# Altium project NetworkModule.PrjPcb
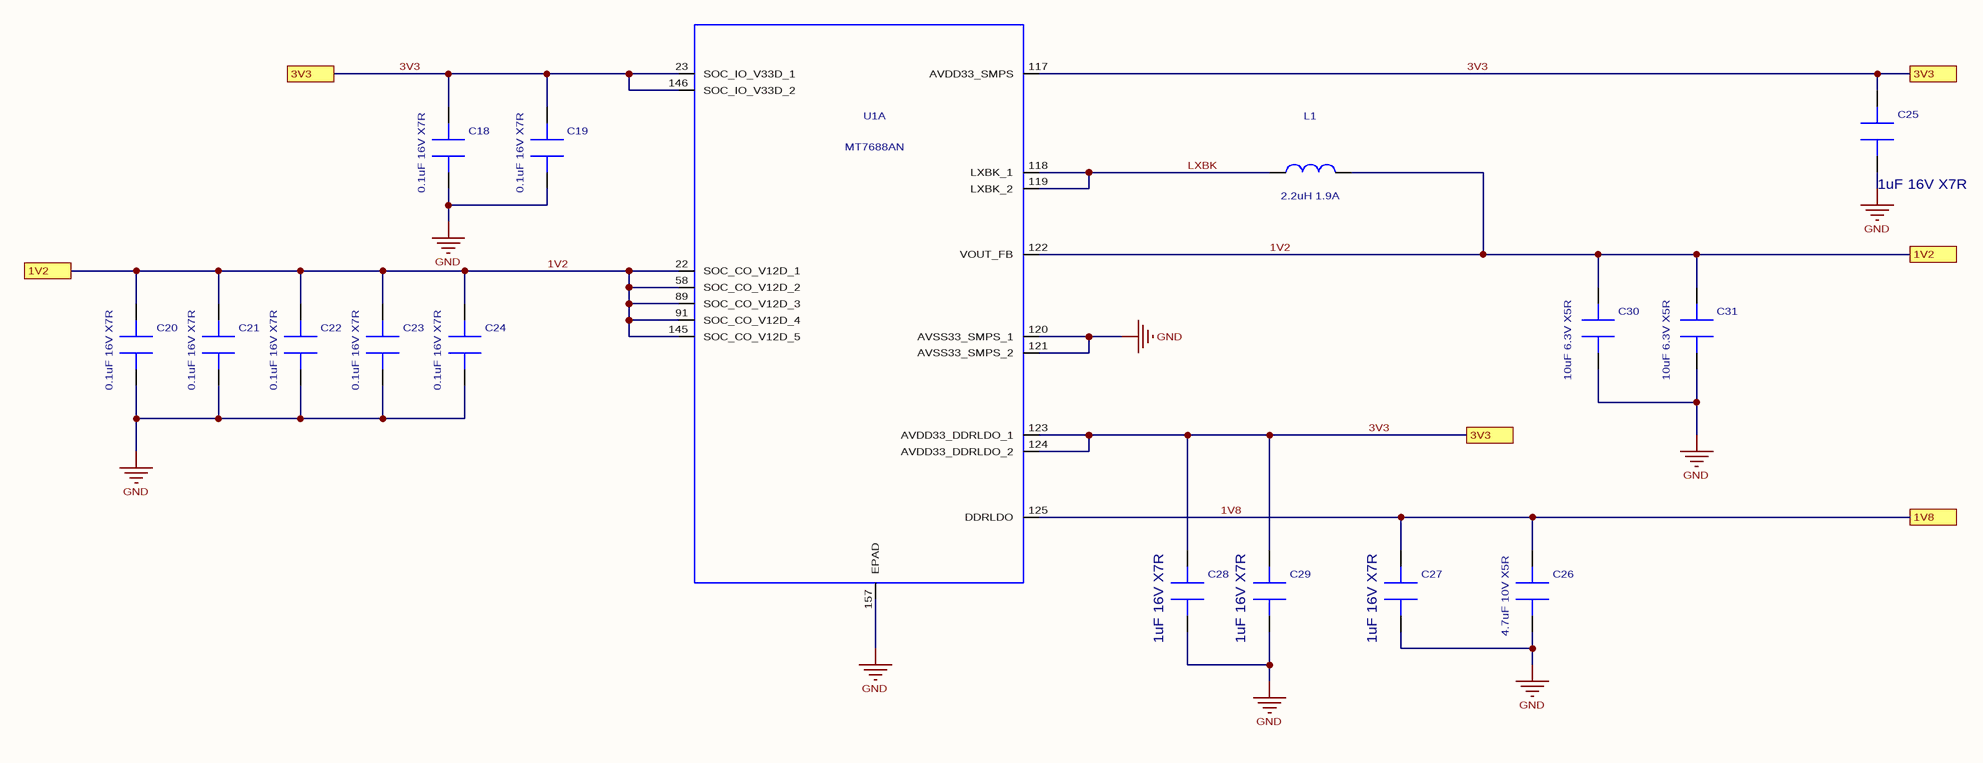
[diagram p0: POWER.SchDoc]
6 sheets, 109 parts. Net scope: flat (ports and power ports of the same name join across sheets).
Board file: NetworkModule.PcbDoc
Sheets:
  POWER.SchDoc
  MEMORY.SchDoc
  MISC.SchDoc
  ETH_JTAG_SD.SchDoc
  WIFI.SchDoc
  USB_PCIE.SchDoc

## Sheet POWER.SchDoc: Network Module
size 431 x 279 mm; DrawnBy: Bin Xiao; Organization: RYSE Inc.

### Parts
C18  value 0.1uF 16V X7R  [C0201]  (hidden comment: CAP0201-104-16V-X7R)
C19  value 0.1uF 16V X7R  [C0201]  (hidden comment: CAP0201-104-16V-X7R)
C20  value 0.1uF 16V X7R  [C0201]  (hidden comment: CAP0201-104-16V-X7R)
C21  value 0.1uF 16V X7R  [C0201]  (hidden comment: CAP0201-104-16V-X7R)
C22  value 0.1uF 16V X7R  [C0201]  (hidden comment: CAP0201-104-16V-X7R)
C23  value 0.1uF 16V X7R  [C0201]  (hidden comment: CAP0201-104-16V-X7R)
C24  value 0.1uF 16V X7R  [C0201]  (hidden comment: CAP0201-104-16V-X7R)
C25  value 1uF 16V X7R  [C0402]  (hidden comment: CAP0402-105-6.3V-X7R)
C26  value 4.7uF 10V X5R  [C0402]  (hidden comment: CAP0402-475-10V-X5R)
C27  value 1uF 16V X7R  [C0402]  (hidden comment: CAP0402-105-6.3V-X7R)
C28  value 1uF 16V X7R  [C0402]  (hidden comment: CAP0402-105-6.3V-X7R)
C29  value 1uF 16V X7R  [C0402]  (hidden comment: CAP0402-105-6.3V-X7R)
C30  value 10uF 6.3V X5R  [C0402]  (hidden comment: CAP0402-106-6.3V-X5R)
C31  value 10uF 6.3V X5R  [C0402]  (hidden comment: CAP0402-106-6.3V-X5R)
L1  value 2.2uH 1.9A  [L0805]  (hidden comment: IND0805_2.2U_1.9A)
U1  MT7688AN  [DR-QFN-128]  (part A of 6)

### Ports
1V2, 1V8, 3V3

### Nets
GND: C18.2 C19.2 C20.2 C21.2 C22.2 C23.2 C24.2 C25.2 C26.2 C27.2 C28.2 C29.2 C30.2 C31.2 U1.120(AVSS33_SMPS_1) U1.121(AVSS33_SMPS_2) U1.157(EPAD)
1V2: C20.1 C21.1 C22.1 C23.1 C24.1 C30.1 C31.1 L1.2 U1.22(SOC_CO_V12D_1) U1.58(SOC_CO_V12D_2) U1.89(SOC_CO_V12D_3) U1.91(SOC_CO_V12D_4) U1.122(VOUT_FB) U1.145(SOC_CO_V12D_5) ; port 1V2
1V8: C26.1 C27.1 U1.125(DDRLDO) ; port 1V8
3V3: C18.1 C19.1 C25.1 C28.1 C29.1 U1.23(SOC_IO_V33D_1) U1.117(AVDD33_SMPS) U1.123(AVDD33_DDRLDO_1) U1.124(AVDD33_DDRLDO_2) U1.146(SOC_IO_V33D_2) ; port 3V3
LXBK: L1.1 U1.118(LXBK_1) U1.119(LXBK_2)

### Library data of the parts
C18-C24 = CAP0201-104-16V-X7R: CAP CER 0.1UF 16V X7R 0201; Part Number: GRM033Z71C104KE14D; Manufacturer: Murata Electronics; Prefered Vender: Digikey; Aligni Value: 0.1u; Type: Capacitor; Geometry.Height: 0.33mm; PCB DECAL: RC0201; Revision: A
C25 C27-C29 = CAP0402-105-6.3V-X7R: CAP CER 1UF 6.3V X7R 0402; Part Number: GRM155R70J105KA12D; Manufacturer: Murata Electronics; Prefered Vender: Digikey; Aligni Value: 1u; Type: Capacitor; Geometry.Height: 0.33mm; PCB DECAL: RC0402; Revision: A
C26 = CAP0402-475-10V-X5R: CAP CER 4.7UF 10V X5R 0402; Part Number: CL05A475MP5NRNC; Manufacturer: Samsung Electro-Mechanics; Prefered Vender: Digikey; Aligni Value: 4.7u; Type: Capacitor; Geometry.Height: 0.33mm; PCB DECAL: RC0402; Revision: A
C30 C31 = CAP0402-475-10V-X5R: CAP CER 10UF 6.3V X5R 0402; Part Number: GRM155R60J106ME05J; Manufacturer: Murata Electronics; Prefered Vender: Digikey; Aligni Value: 10u; Type: Capacitor; Geometry.Height: 0.33mm; Revision: A; PCB DECAL: C0402
L1 = IND0805_2.2U_1.9A: POWER CHOKE MOLDED 2.2UH 1.9A; Part Number: WLPH201610M2R2PP; Manufacturer: Walsin Technology Corporation; Prefered Vender: Digikey; Geometry.Height: 1.5mm; Aligni Value: 2.2u; Type: Inductor; PCB DECAL: RC0805; Revision: A
U1 = MT7688AN: 580Mhz 32bits Networking Processor; Manufacturer: MediaTek Inc; Geometry.Height: 0mm; Type: IC; Part Number: MT7688AN; PCB DECAL: DR-QFN-128

## Sheet MEMORY.SchDoc: Network Module
size 431 x 279 mm; DrawnBy: Bin Xiao; Organization: RYSE Inc.; Revision: A
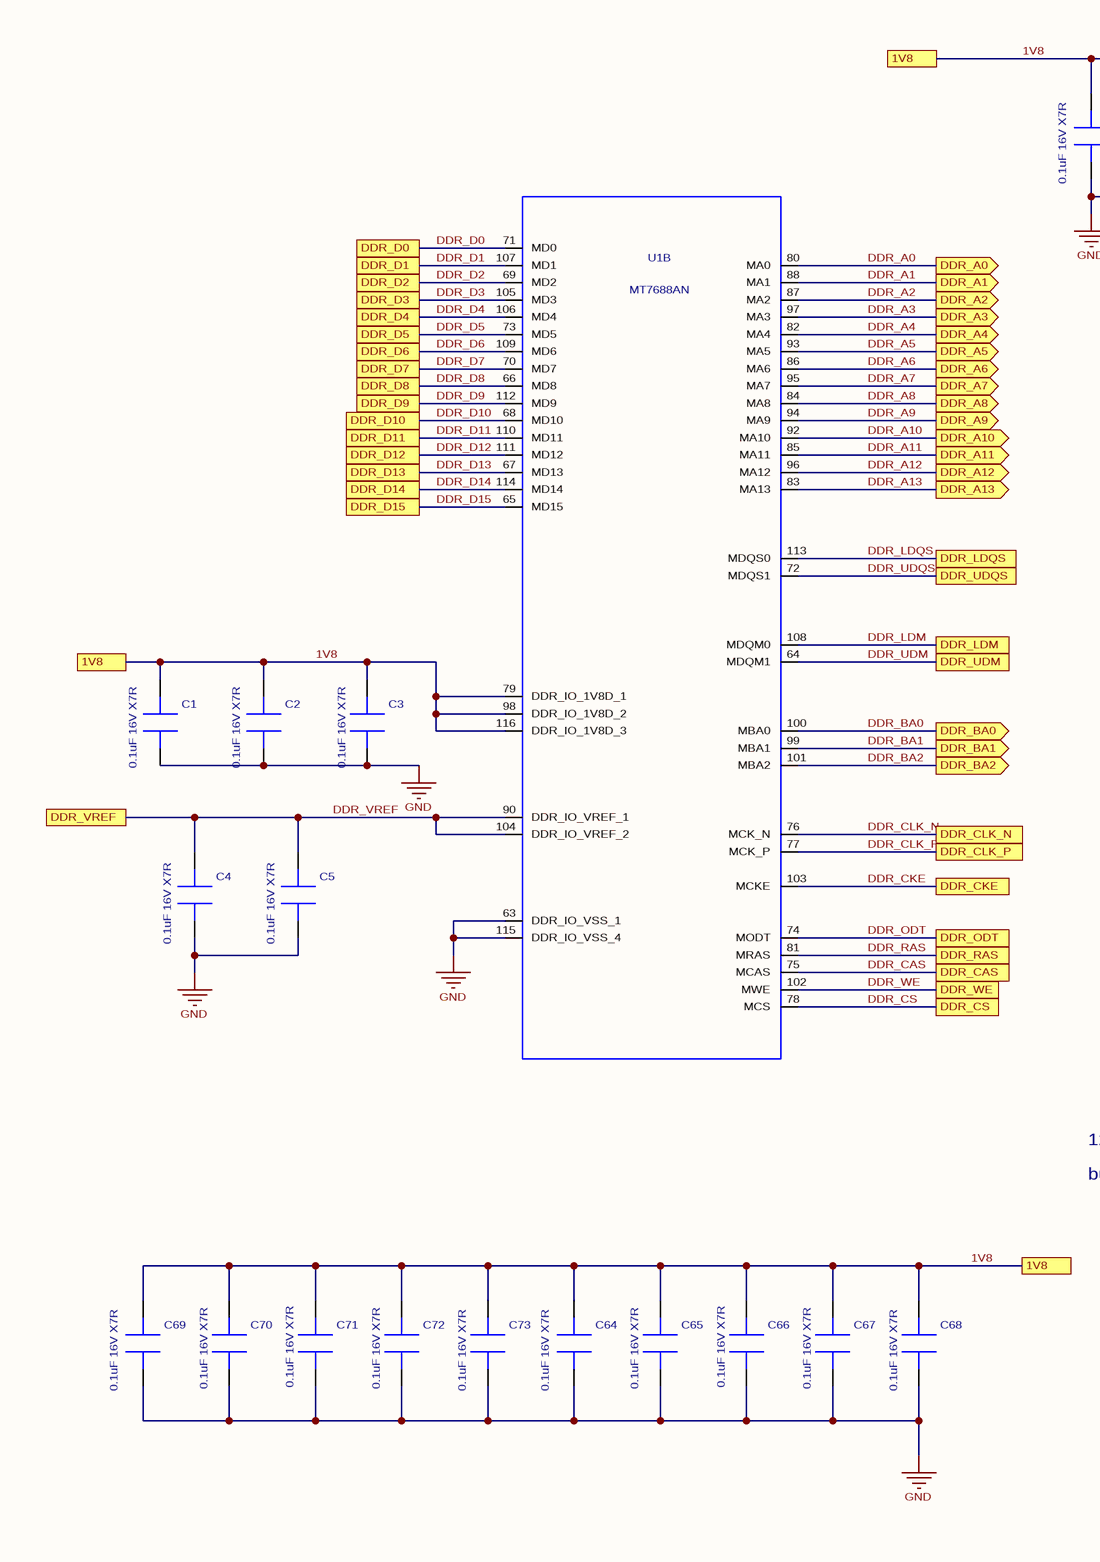
[diagram p1: MEMORY.SchDoc, left]
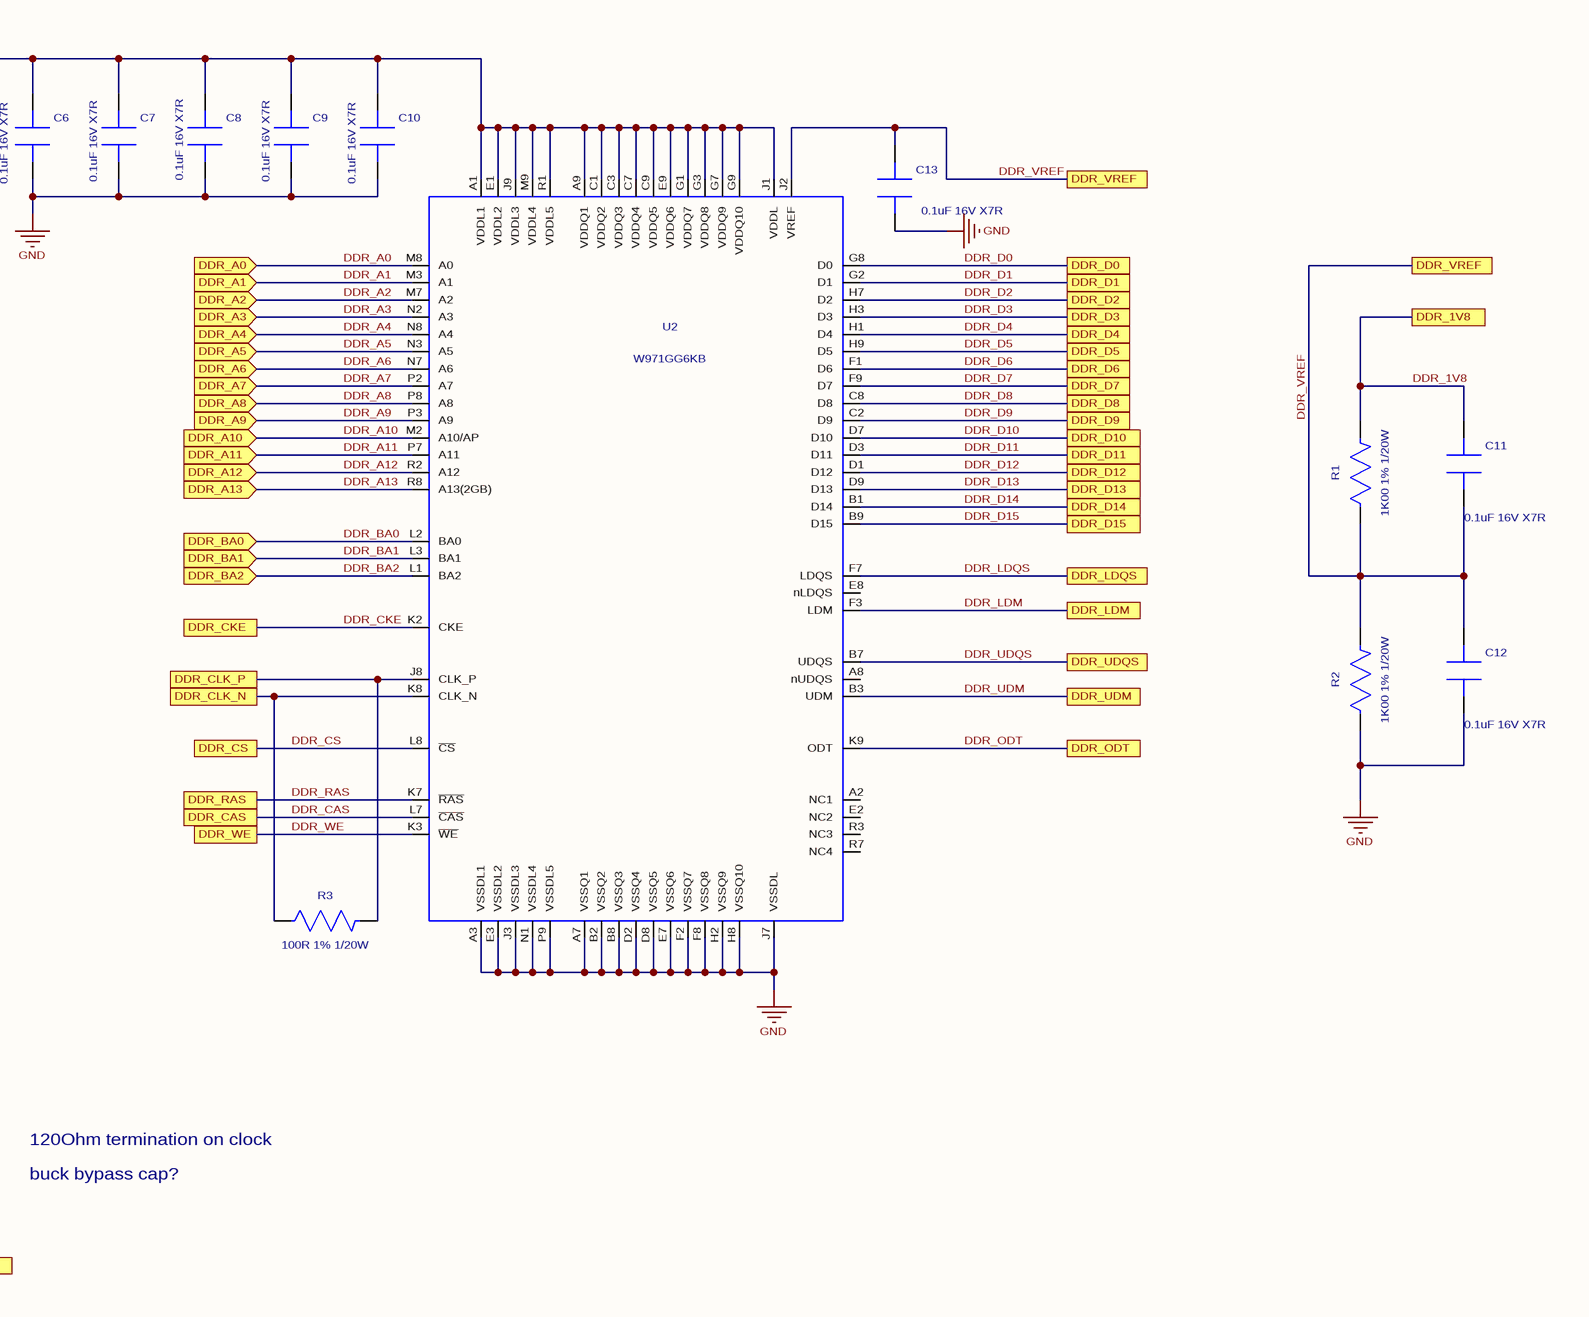
[diagram p2: MEMORY.SchDoc, right]

### Parts
C1  value 0.1uF 16V X7R  [C0201]  (hidden comment: CAP0201-104-16V-X7R)
C2  value 0.1uF 16V X7R  [C0201]  (hidden comment: CAP0201-104-16V-X7R)
C3  value 0.1uF 16V X7R  [C0201]  (hidden comment: CAP0201-104-16V-X7R)
C4  value 0.1uF 16V X7R  [C0201]  (hidden comment: CAP0201-104-16V-X7R)
C5  value 0.1uF 16V X7R  [C0201]  (hidden comment: CAP0201-104-16V-X7R)
C6  value 0.1uF 16V X7R  [C0201]  (hidden comment: CAP0201-104-16V-X7R)
C7  value 0.1uF 16V X7R  [C0201]  (hidden comment: CAP0201-104-16V-X7R)
C8  value 0.1uF 16V X7R  [C0201]  (hidden comment: CAP0201-104-16V-X7R)
C9  value 0.1uF 16V X7R  [C0201]  (hidden comment: CAP0201-104-16V-X7R)
C10  value 0.1uF 16V X7R  [C0201]  (hidden comment: CAP0201-104-16V-X7R)
C11  value 0.1uF 16V X7R  [C0201]  (hidden comment: CAP0201-104-16V-X7R)
C12  value 0.1uF 16V X7R  [C0201]  (hidden comment: CAP0201-104-16V-X7R)
C13  value 0.1uF 16V X7R  [C0201]  (hidden comment: CAP0201-104-16V-X7R)
C64  value 0.1uF 16V X7R  [C0201]  (hidden comment: CAP0201-104-16V-X7R)
C65  value 0.1uF 16V X7R  [C0201]  (hidden comment: CAP0201-104-16V-X7R)
C66  value 0.1uF 16V X7R  [C0201]  (hidden comment: CAP0201-104-16V-X7R)
C67  value 0.1uF 16V X7R  [C0201]  (hidden comment: CAP0201-104-16V-X7R)
C68  value 0.1uF 16V X7R  [C0201]  (hidden comment: CAP0201-104-16V-X7R)
C69  value 0.1uF 16V X7R  [C0201]  (hidden comment: CAP0201-104-16V-X7R)
C70  value 0.1uF 16V X7R  [C0201]  (hidden comment: CAP0201-104-16V-X7R)
C71  value 0.1uF 16V X7R  [C0201]  (hidden comment: CAP0201-104-16V-X7R)
C72  value 0.1uF 16V X7R  [C0201]  (hidden comment: CAP0201-104-16V-X7R)
C73  value 0.1uF 16V X7R  [C0201]  (hidden comment: CAP0201-104-16V-X7R)
R1  value 1K00 1% 1/20W  [R0201]  (hidden comment: RES0201-1K00)
R2  value 1K00 1% 1/20W  [R0201]  (hidden comment: RES0201-1K00)
R3  value 100R 1% 1/20W  [R0201]  (hidden comment: RES0201-100R)
U1  MT7688AN  [DR-QFN-128]  (part B of 6)
U2  W971GG6KB  [TWBGA-84_8X12P5_ISI]

### Ports
1V8, DDR_1V8, DDR_A0 (in), DDR_A0 (out), DDR_A1 (in), DDR_A1 (out), DDR_A2 (in), DDR_A2 (out), DDR_A3 (in), DDR_A3 (out), DDR_A4 (in), DDR_A4 (out), DDR_A5 (in), DDR_A5 (out), DDR_A6 (in), DDR_A6 (out), DDR_A7 (in), DDR_A7 (out), DDR_A8 (in), DDR_A8 (out), DDR_A9 (in), DDR_A9 (out), DDR_A10 (in), DDR_A10 (out), DDR_A11 (in), DDR_A11 (out), DDR_A12 (in), DDR_A12 (out), DDR_A13 (in), DDR_A13 (out), DDR_BA0 (in), DDR_BA0 (out), DDR_BA1 (in), DDR_BA1 (out), DDR_BA2 (in), DDR_BA2 (out), DDR_CAS, DDR_CKE, DDR_CLK_N, DDR_CLK_P, DDR_CS, DDR_D0, DDR_D1, DDR_D2, DDR_D3, DDR_D4, DDR_D5, DDR_D6, DDR_D7, DDR_D8, DDR_D9, DDR_D10, DDR_D11, DDR_D12, DDR_D13, DDR_D14, DDR_D15, DDR_LDM, DDR_LDQS, DDR_ODT, DDR_RAS, DDR_UDM, DDR_UDQS, DDR_VREF, DDR_WE

### Nets
GND: C1.2 C2.2 C3.2 C4.2 C5.2 C6.2 C7.2 C8.2 C9.2 C10.2 C12.2 C13.2 C64.2 C65.2 C66.2 C67.2 C68.2 C69.2 C70.2 C71.2 C72.2 C73.2 R2.1 U1.63(DDR_IO_VSS_1) U1.115(DDR_IO_VSS_4) U2.A3(VSSDL1) U2.A7(VSSQ1) U2.B2(VSSQ2) U2.B8(VSSQ3) U2.D2(VSSQ4) U2.D8(VSSQ5) U2.E3(VSSDL2) U2.E7(VSSQ6) U2.F2(VSSQ7) U2.F8(VSSQ8) U2.H2(VSSQ9) U2.H8(VSSQ10) U2.J3(VSSDL3) U2.J7(VSSDL) U2.N1(VSSDL4) U2.P9(VSSDL5)
1V8: C1.1 C2.1 C3.1 C6.1 C7.1 C8.1 C9.1 C10.1 C64.1 C65.1 C66.1 C67.1 C68.1 C69.1 C70.1 C71.1 C72.1 C73.1 U1.79(DDR_IO_1V8D_1) U1.98(DDR_IO_1V8D_2) U1.116(DDR_IO_1V8D_3) U2.A1(VDDL1) U2.A9(VDDQ1) U2.C1(VDDQ2) U2.C3(VDDQ3) U2.C7(VDDQ4) U2.C9(VDDQ5) U2.E1(VDDL2) U2.E9(VDDQ6) U2.G1(VDDQ7) U2.G3(VDDQ8) U2.G7(VDDQ9) U2.G9(VDDQ10) U2.J1(VDDL) U2.J9(VDDL3) U2.M9(VDDL4) U2.R1(VDDL5) ; port 1V8
DDR_1V8: C11.1 R1.2 ; port DDR_1V8
DDR_A0: U1.80(MA0) U2.M8(A0) ; port DDR_A0
DDR_A1: U1.88(MA1) U2.M3(A1) ; port DDR_A1
DDR_A2: U1.87(MA2) U2.M7(A2) ; port DDR_A2
DDR_A3: U1.97(MA3) U2.N2(A3) ; port DDR_A3
DDR_A4: U1.82(MA4) U2.N8(A4) ; port DDR_A4
DDR_A5: U1.93(MA5) U2.N3(A5) ; port DDR_A5
DDR_A6: U1.86(MA6) U2.N7(A6) ; port DDR_A6
DDR_A7: U1.95(MA7) U2.P2(A7) ; port DDR_A7
DDR_A8: U1.84(MA8) U2.P8(A8) ; port DDR_A8
DDR_A9: U1.94(MA9) U2.P3(A9) ; port DDR_A9
DDR_A10: U1.92(MA10) U2.M2(A10/AP) ; port DDR_A10
DDR_A11: U1.85(MA11) U2.P7(A11) ; port DDR_A11
DDR_A12: U1.96(MA12) U2.R2(A12) ; port DDR_A12
DDR_A13: U1.83(MA13) U2.R8(A13(2GB)) ; port DDR_A13
DDR_BA0: U1.100(MBA0) U2.L2(BA0) ; port DDR_BA0
DDR_BA1: U1.99(MBA1) U2.L3(BA1) ; port DDR_BA1
DDR_BA2: U1.101(MBA2) U2.L1(BA2) ; port DDR_BA2
DDR_CAS: U1.75(MCAS) U2.L7(~{CAS}) ; port DDR_CAS
DDR_CKE: U1.103(MCKE) U2.K2(CKE) ; port DDR_CKE
DDR_CLK_N: R3.1 U1.76(MCK_N) U2.K8(CLK_N) ; port DDR_CLK_N
DDR_CLK_P: R3.2 U1.77(MCK_P) U2.J8(CLK_P) ; port DDR_CLK_P
DDR_CS: U1.78(MCS) U2.L8(~{CS}) ; port DDR_CS
DDR_D0: U1.71(MD0) U2.G8(D0) ; port DDR_D0
DDR_D1: U1.107(MD1) U2.G2(D1) ; port DDR_D1
DDR_D2: U1.69(MD2) U2.H7(D2) ; port DDR_D2
DDR_D3: U1.105(MD3) U2.H3(D3) ; port DDR_D3
DDR_D4: U1.106(MD4) U2.H1(D4) ; port DDR_D4
DDR_D5: U1.73(MD5) U2.H9(D5) ; port DDR_D5
DDR_D6: U1.109(MD6) U2.F1(D6) ; port DDR_D6
DDR_D7: U1.70(MD7) U2.F9(D7) ; port DDR_D7
DDR_D8: U1.66(MD8) U2.C8(D8) ; port DDR_D8
DDR_D9: U1.112(MD9) U2.C2(D9) ; port DDR_D9
DDR_D10: U1.68(MD10) U2.D7(D10) ; port DDR_D10
DDR_D11: U1.110(MD11) U2.D3(D11) ; port DDR_D11
DDR_D12: U1.111(MD12) U2.D1(D12) ; port DDR_D12
DDR_D13: U1.67(MD13) U2.D9(D13) ; port DDR_D13
DDR_D14: U1.114(MD14) U2.B1(D14) ; port DDR_D14
DDR_D15: U1.65(MD15) U2.B9(D15) ; port DDR_D15
DDR_LDM: U1.108(MDQM0) U2.F3(LDM) ; port DDR_LDM
DDR_LDQS: U1.113(MDQS0) U2.F7(LDQS) ; port DDR_LDQS
DDR_ODT: U1.74(MODT) U2.K9(ODT) ; port DDR_ODT
DDR_RAS: U1.81(MRAS) U2.K7(~{RAS}) ; port DDR_RAS
DDR_UDM: U1.64(MDQM1) U2.B3(UDM) ; port DDR_UDM
DDR_UDQS: U1.72(MDQS1) U2.B7(UDQS) ; port DDR_UDQS
DDR_VREF: C4.1 C5.1 C11.2 C12.1 C13.1 R1.1 R2.2 U1.90(DDR_IO_VREF_1) U1.104(DDR_IO_VREF_2) U2.J2(VREF) ; port DDR_VREF
DDR_WE: U1.102(MWE) U2.K3(~{WE}) ; port DDR_WE

Not connected (* = marked no-connect by the designer): U2 A2(NC1) A8(nUDQS) E2(NC2) E8(nLDQS) R3(NC3) R7(NC4)

### Notes on the sheet
- 120Ohm termination on clock
- buck bypass cap?

### Library data of the parts
C1-C13 C64-C73 = CAP0201-104-16V-X7R: as C18 on sheet POWER; Revision: A
R1 R2 = RES0201-1K00: RES 1K OHM 1% 1/20W 0201; Part Number: RMCF0201FT1K00; Manufacturer: Stackpole Electronics Inc; Prefered Vender: Digikey; Geometry.Height: 0.6mm; PCB DECAL: RC0201; Aligni Value: 1k; Revision: A; Type: Resistor
R3 = RES0201-100R: RES 100 OHM 1% 1/20W 0201; Manufacturer: Yageo; Part Number: RC0201FR-07100RL; Geometry.Height: 0.5mm; Prefered Vender: Digikey; Aligni Value: 100; PCB DECAL: RC0201; Type: Resistor; Revision: A
U1 = MT7688AN: as U1 on sheet POWER; Type: IC; Part Number: MT7688AN; PCB DECAL: DR-QFN-128
U2 = W971GG6KB: IC DRAM 1GBIT PARALLEL 84WBGA; Manufacture: Winbond Electronics; Part Number: W971GG6KB-25 TR; Prefered Vender: Digikey; PCB DECAL: TWBGA-84_8X12P5_ISI; Type: IC

## Sheet MISC.SchDoc: Network Module
size 431 x 279 mm; DrawnBy: Bin Xiao; Organization: RYSE Inc.
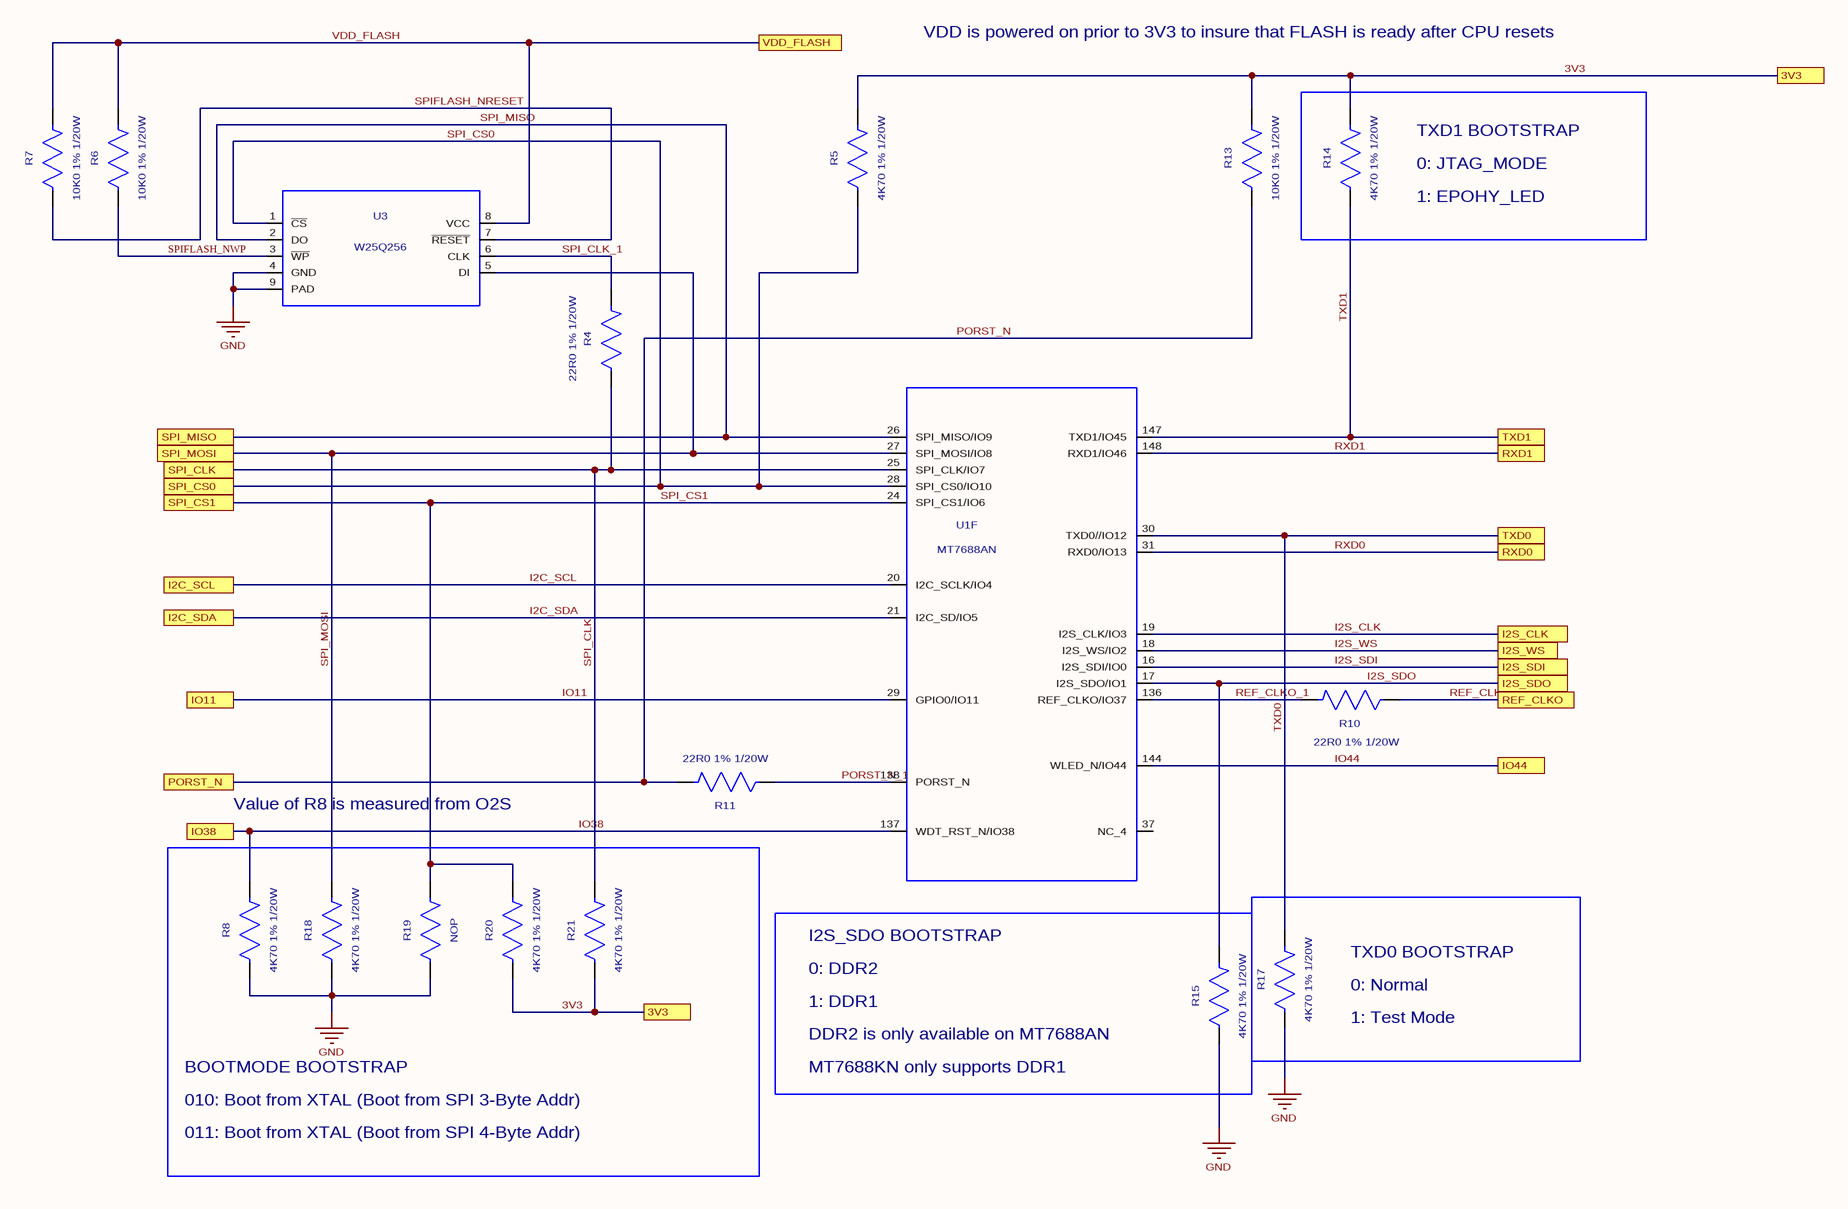
[diagram p3: MISC.SchDoc]

### Parts
R4  value 22R0 1% 1/20W  [R0201]  (hidden comment: RES0201-22R0)
R5  value 4K70 1% 1/20W  [R0201]  (hidden comment: RES0201-4K70)
R6  value 10K0 1% 1/20W  [R0201]  (hidden comment: RES0201-10K0)
R7  value 10K0 1% 1/20W  [R0201]  (hidden comment: RES0201-10K0)
R8  value 4K70 1% 1/20W  [R0201]  (hidden comment: RES0201-4K70)
R10  value 22R0 1% 1/20W  [R0201]  (hidden comment: RES0201-22R0)
R11  value 22R0 1% 1/20W  [R0201]  (hidden comment: RES0201-22R0)
R13  value 10K0 1% 1/20W  [R0201]  (hidden comment: RES0201-10K0)
R14  value 4K70 1% 1/20W  [R0201]  (hidden comment: RES0201-4K70)
R15  value 4K70 1% 1/20W  [R0201]  (hidden comment: RES0201-4K70)
R17  value 4K70 1% 1/20W  [R0201]  (hidden comment: RES0201-4K70)
R18  value 4K70 1% 1/20W  [R0201]  (hidden comment: RES0201-4K70)
R19  value NOP  [R0201_NOP]  (hidden comment: RES0201-NOP)
R20  value 4K70 1% 1/20W  [R0201]  (hidden comment: RES0201-4K70)
R21  value 4K70 1% 1/20W  [R0201]  (hidden comment: RES0201-4K70)
U1  MT7688AN  [DR-QFN-128]  (part F of 6)
U3  W25Q256  [WIN_E-8_WIN]

### Ports
3V3, I2C_SCL, I2C_SDA, I2S_CLK, I2S_SDI, I2S_SDO, I2S_WS, IO11, IO38, IO44, PORST_N, REF_CLKO, RXD0, RXD1, SPI_CLK, SPI_CS0, SPI_CS1, SPI_MISO, SPI_MOSI, TXD0, TXD1, VDD_FLASH

### Nets
GND: R8.1 R15.1 R17.1 R18.1 R19.1 U3.4(GND) U3.9(PAD)
3V3: R5.2 R13.2 R14.2 R20.1 R21.1 ; port 3V3
I2C_SCL: U1.20(I2C_SCLK/IO4) ; port I2C_SCL
I2C_SDA: U1.21(I2C_SD/IO5) ; port I2C_SDA
I2S_CLK: U1.19(I2S_CLK/IO3) ; port I2S_CLK
I2S_SDI: U1.16(I2S_SDI/IO0) ; port I2S_SDI
I2S_SDO: R15.2 U1.17(I2S_SDO/IO1) ; port I2S_SDO
I2S_WS: U1.18(I2S_WS/IO2) ; port I2S_WS
IO11: U1.29(GPIO0/IO11) ; port IO11
IO38: R8.2 U1.137(WDT_RST_N/IO38) ; port IO38
IO44: U1.144(WLED_N/IO44) ; port IO44
PORST_N: R11.2 R13.1 ; port PORST_N
PORST_N_1: R11.1 U1.138(PORST_N)
REF_CLKO: R10.1 ; port REF_CLKO
REF_CLKO_1: R10.2 U1.136(REF_CLKO/IO37)
RXD0: U1.31(RXD0/IO13) ; port RXD0
RXD1: U1.148(RXD1/IO46) ; port RXD1
SPI_CLK: R4.1 R21.2 U1.25(SPI_CLK/IO7) ; port SPI_CLK
SPI_CLK_1: R4.2 U3.6(CLK)
SPI_CS0: R5.1 U1.28(SPI_CS0/IO10) U3.1(~{CS}) ; port SPI_CS0
SPI_CS1: R19.2 R20.2 U1.24(SPI_CS1/IO6) ; port SPI_CS1
SPI_MISO: U1.26(SPI_MISO/IO9) U3.2(DO) ; port SPI_MISO
SPI_MOSI: R18.2 U1.27(SPI_MOSI/IO8) U3.5(DI) ; port SPI_MOSI
SPIFLASH_NRESET: R7.1 U3.7(~{RESET})
SPIFLASH_NWP: R6.1 U3.3(~{WP})
TXD0: R17.2 U1.30(TXD0//IO12) ; port TXD0
TXD1: R14.1 U1.147(TXD1/IO45) ; port TXD1
VDD_FLASH: R6.2 R7.2 U3.8(VCC) ; port VDD_FLASH

Not connected (* = marked no-connect by the designer): U1 37(NC_4)

### Notes on the sheet
- VDD is powered on prior to 3V3 to insure that FLASH is ready after CPU resets
- 0: JTAG_MODE
- 1: EPOHY_LED
- TXD1 BOOTSTRAP
- Value of R8 is measured from O2S
- I2S_SDO BOOTSTRAP
- 0: DDR2
- 1: DDR1
- TXD0 BOOTSTRAP
- 0: Normal
- 1: Test Mode
- 010: Boot from XTAL (Boot from SPI 3-Byte Addr)
- BOOTMODE BOOTSTRAP
- DDR2 is only available on MT7688AN
- MT7688KN only supports DDR1
- 011: Boot from XTAL (Boot from SPI 4-Byte Addr)

### Library data of the parts
R4 R10 R11 = RES0201-22R0: RES 22 OHM 1% 1/20W 0201; Manufacturer: Yageo; Part Number: RC0201FR-0722RL; Geometry.Height: 0.5mm; Prefered Vender: Digikey; Aligni Value: 22; PCB DECAL: RC0201; Type: Resistor; Revision: A
R5 R8 R14 R15 R17 R18 R20 R21 = RES0201-4K70: RES 4.7K OHM 1% 1/20W 0201; Manufacturer: Yageo; Part Number: RC0201FR-074K7L; Geometry.Height: 0.5mm; Prefered Vender: Digikey; PCB DECAL: RC0201; Type: Resistor; Revision: A; Aligni Value: 4.7k
R6 R7 R13 = RES0201-10K0: RES SMD 10K OHM 1% 1/20W 0201; Manufacturer: Yageo; Part Number: RC0201FR-0710KP; Geometry.Height: 0.5mm; Prefered Vender: Digikey; PCB DECAL: RC0201; Type: Resistor; Revision: A; Aligni Value: 10k
R19 = RES0201-NOP: NOP; Geometry.Height: 0mm; PCB DECAL: RC0201; Manufacturer: NOP; Type: Resistor; Revision: A; Prefered Vender: NOP; Aligni Value: NOP; Part Number: NOP
U1 = MT7688AN: as U1 on sheet POWER; Type: IC; Part Number: MT7688AN; PCB DECAL: DR-QFN-128
U3 = W25Q256: IC FLASH 256MBIT SPI/QUAD 8WSON; Manufacture: Winbond Electronics; Part Number: W25Q256JVEIQ; Prefered Vender: Digikey; PCB DECAL: WIN_E-8_WIN; Type: IC

## Sheet ETH_JTAG_SD.SchDoc: Network Module
size 431 x 279 mm; DrawnBy: Bin Xiao; Organization: RYSE Inc.
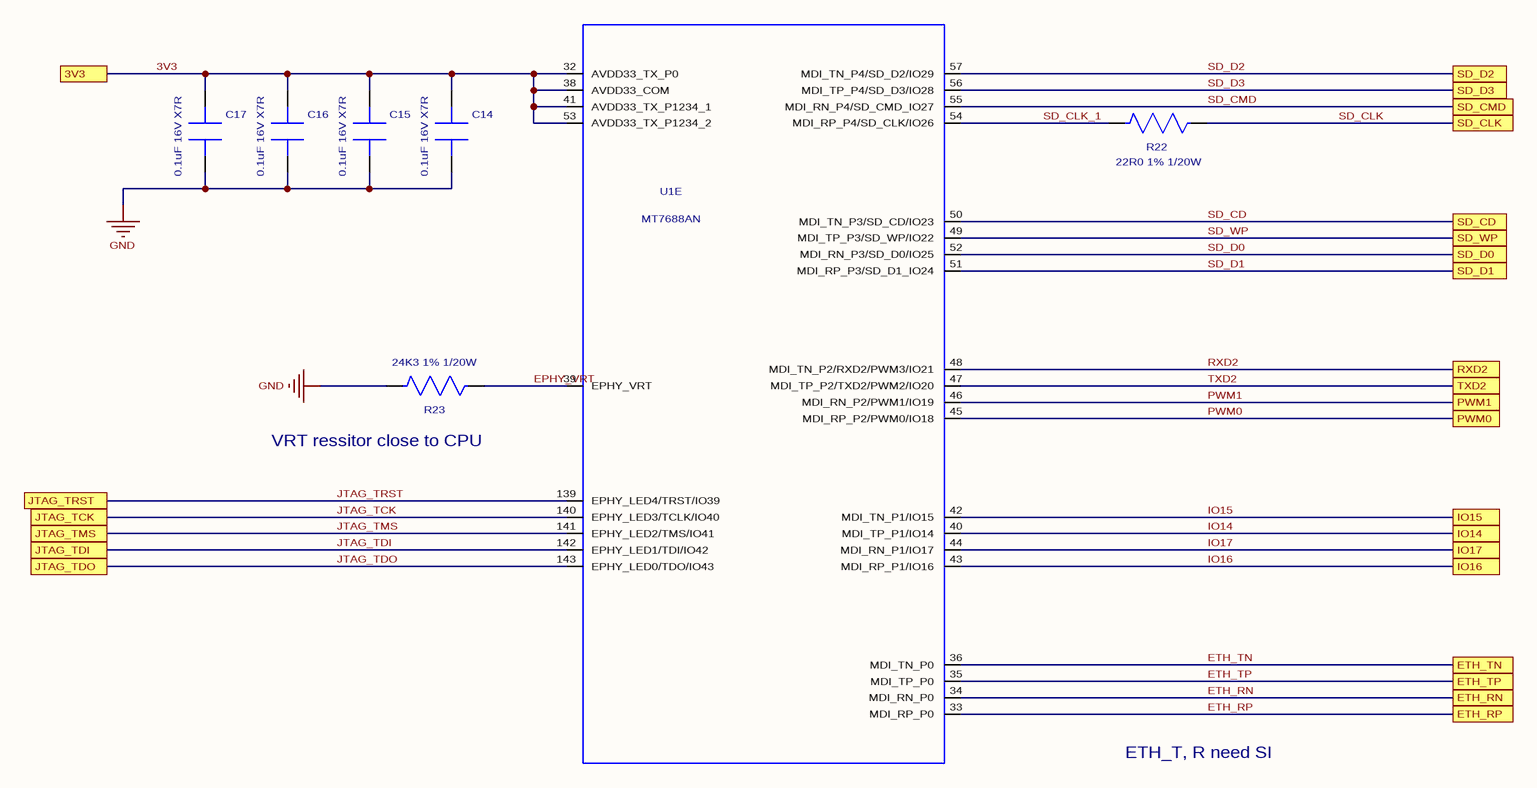
[diagram p4: ETH_JTAG_SD.SchDoc]

### Parts
C14  value 0.1uF 16V X7R  [C0201]  (hidden comment: CAP0201-104-16V-X7R)
C15  value 0.1uF 16V X7R  [C0201]  (hidden comment: CAP0201-104-16V-X7R)
C16  value 0.1uF 16V X7R  [C0201]  (hidden comment: CAP0201-104-16V-X7R)
C17  value 0.1uF 16V X7R  [C0201]  (hidden comment: CAP0201-104-16V-X7R)
R22  value 22R0 1% 1/20W  [R0201]  (hidden comment: RES0201-22R0)
R23  value 24K3 1% 1/20W  [R0201]  (hidden comment: RES0201-24K3)
U1  MT7688AN  [DR-QFN-128]  (part E of 6)

### Ports
3V3, ETH_RN, ETH_RP, ETH_TN, ETH_TP, IO14, IO15, IO16, IO17, JTAG_TCK, JTAG_TDI, JTAG_TDO, JTAG_TMS, JTAG_TRST, PWM0, PWM1, RXD2, SD_CD, SD_CLK, SD_CMD, SD_D0, SD_D1, SD_D2, SD_D3, SD_WP, TXD2

### Nets
GND: C14.2 C15.2 C16.2 C17.2 R23.2
3V3: C14.1 C15.1 C16.1 C17.1 U1.32(AVDD33_TX_P0) U1.38(AVDD33_COM) U1.41(AVDD33_TX_P1234_1) U1.53(AVDD33_TX_P1234_2) ; port 3V3
EPHY_VRT: R23.1 U1.39(EPHY_VRT)
ETH_RN: U1.34(MDI_RN_P0) ; port ETH_RN
ETH_RP: U1.33(MDI_RP_P0) ; port ETH_RP
ETH_TN: U1.36(MDI_TN_P0) ; port ETH_TN
ETH_TP: U1.35(MDI_TP_P0) ; port ETH_TP
IO14: U1.40(MDI_TP_P1/IO14) ; port IO14
IO15: U1.42(MDI_TN_P1/IO15) ; port IO15
IO16: U1.43(MDI_RP_P1/IO16) ; port IO16
IO17: U1.44(MDI_RN_P1/IO17) ; port IO17
JTAG_TCK: U1.140(EPHY_LED3/TCLK/IO40) ; port JTAG_TCK
JTAG_TDI: U1.142(EPHY_LED1/TDI/IO42) ; port JTAG_TDI
JTAG_TDO: U1.143(EPHY_LED0/TDO/IO43) ; port JTAG_TDO
JTAG_TMS: U1.141(EPHY_LED2/TMS/IO41) ; port JTAG_TMS
JTAG_TRST: U1.139(EPHY_LED4/TRST/IO39) ; port JTAG_TRST
PWM0: U1.45(MDI_RP_P2/PWM0/IO18) ; port PWM0
PWM1: U1.46(MDI_RN_P2/PWM1/IO19) ; port PWM1
RXD2: U1.48(MDI_TN_P2/RXD2/PWM3/IO21) ; port RXD2
SD_CD: U1.50(MDI_TN_P3/SD_CD/IO23) ; port SD_CD
SD_CLK: R22.1 ; port SD_CLK
SD_CLK_1: R22.2 U1.54(MDI_RP_P4/SD_CLK/IO26)
SD_CMD: U1.55(MDI_RN_P4/SD_CMD_IO27) ; port SD_CMD
SD_D0: U1.52(MDI_RN_P3/SD_D0/IO25) ; port SD_D0
SD_D1: U1.51(MDI_RP_P3/SD_D1_IO24) ; port SD_D1
SD_D2: U1.57(MDI_TN_P4/SD_D2/IO29) ; port SD_D2
SD_D3: U1.56(MDI_TP_P4/SD_D3/IO28) ; port SD_D3
SD_WP: U1.49(MDI_TP_P3/SD_WP/IO22) ; port SD_WP
TXD2: U1.47(MDI_TP_P2/TXD2/PWM2/IO20) ; port TXD2

### Notes on the sheet
- (near R23) VRT ressitor close to CPU
- ETH_T, R need SI

### Library data of the parts
C14-C17 = CAP0201-104-16V-X7R: as C18 on sheet POWER; Revision: A
R22 = RES0201-22R0: as R4 on sheet MISC; Type: Resistor; Revision: A
R23 = RES0201-24K3: RES 24.3K OHM 1% 1/20W 0201; Part Number: RC0201FR-0724K3L; Manufacturer: YAGEO; Prefered Vender: Digikey; Geometry.Height: 0.6mm; PCB DECAL: RC0201; Aligni Value: 24.3k; Revision: A; Type: Resistor
U1 = MT7688AN: as U1 on sheet POWER; Type: IC; Part Number: MT7688AN; PCB DECAL: DR-QFN-128

## Sheet WIFI.SchDoc: Network Module
size 431 x 279 mm; DrawnBy: Bin Xiao; Organization: RYSE Inc.
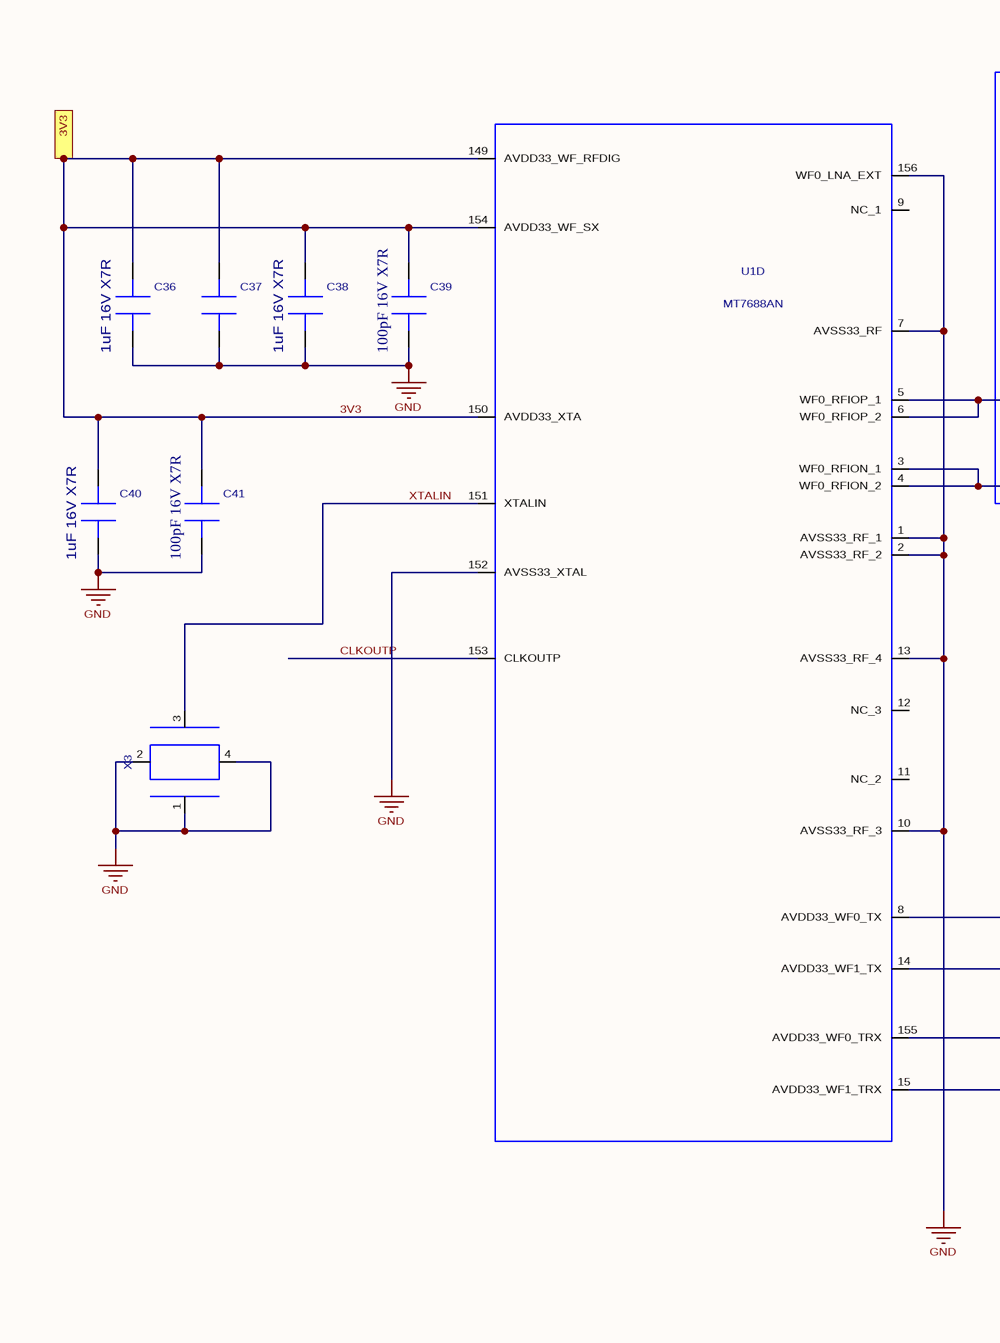
[diagram p5: WIFI.SchDoc, left]
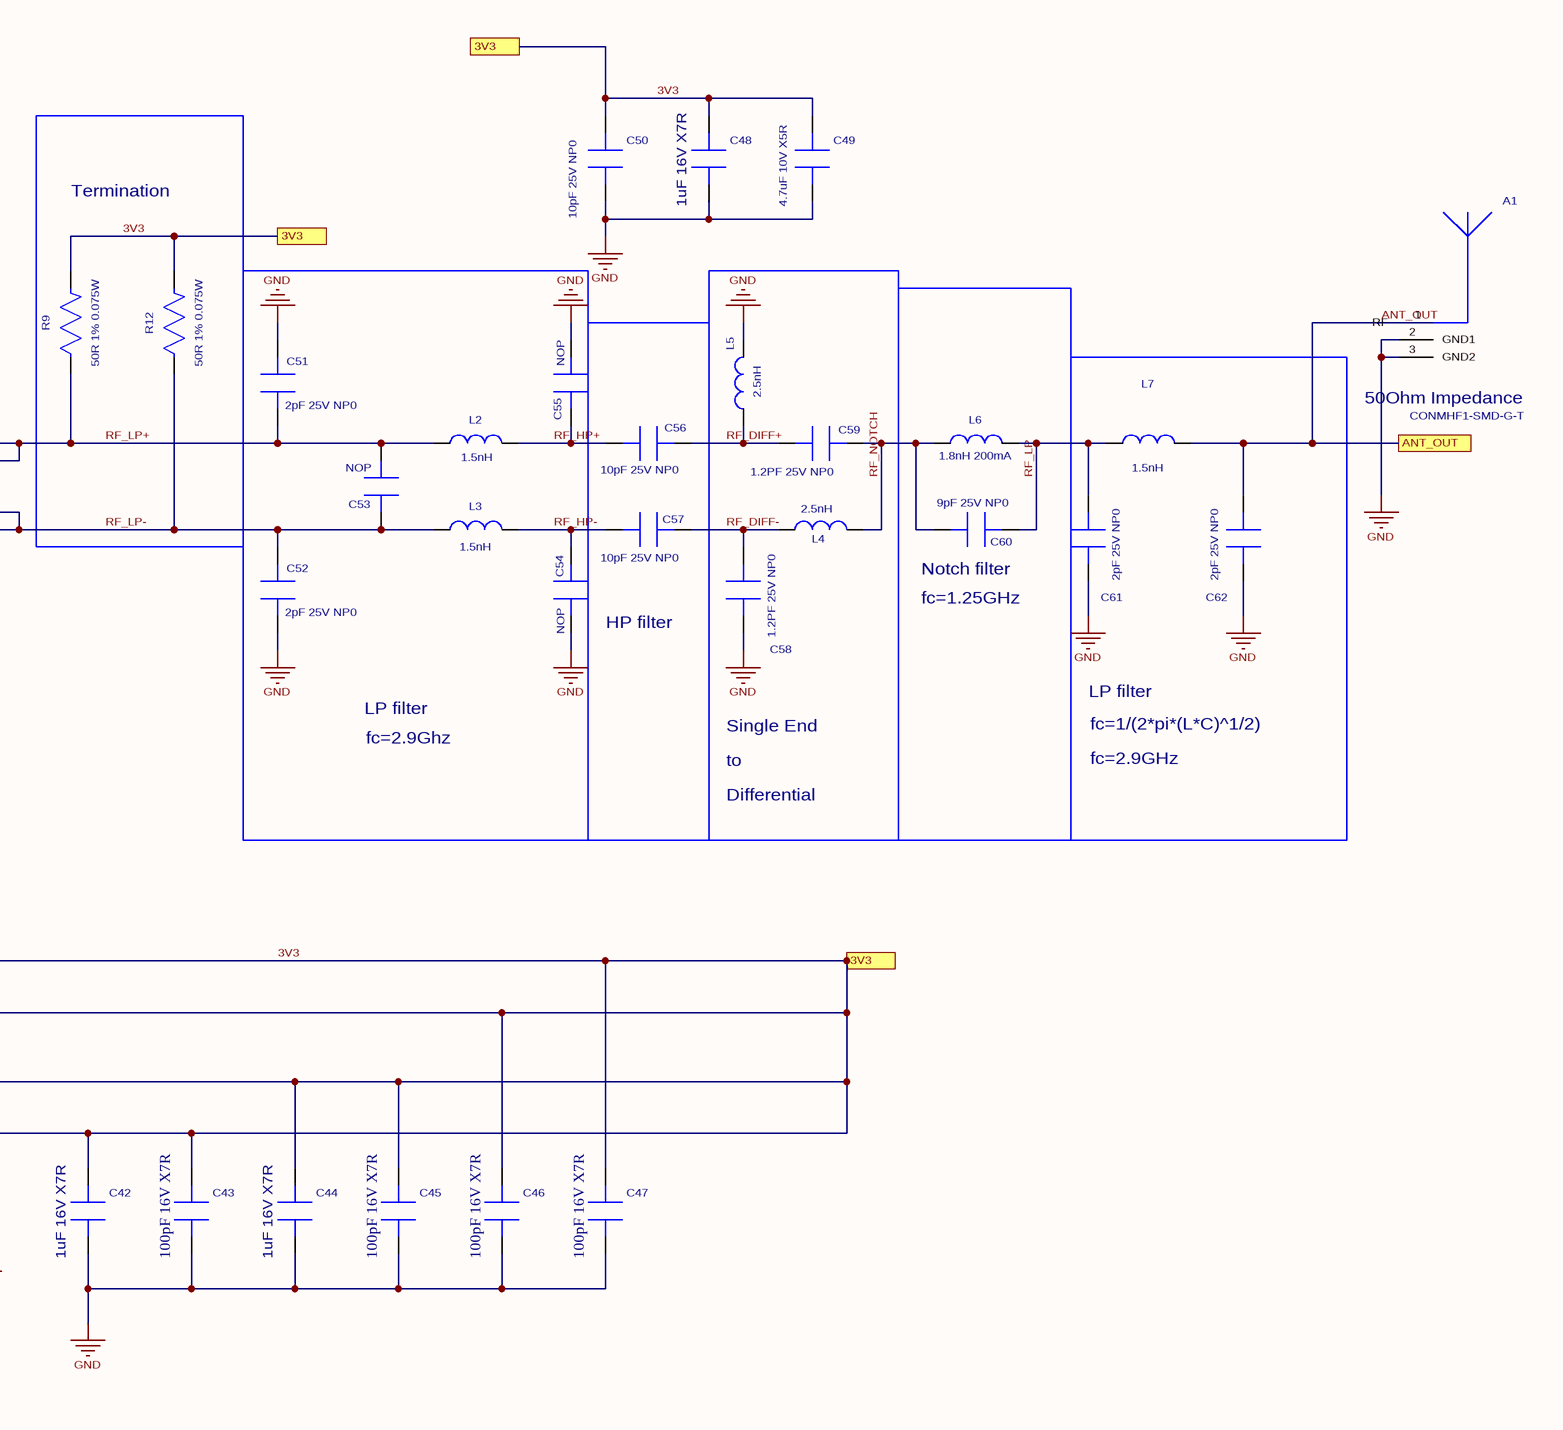
[diagram p6: WIFI.SchDoc, right]

### Parts
A1  CONMHF1-SMD-G-T  [CONMHF1-SMD-G-T]
C36  value 1uF 16V X7R  [C0402]  (hidden comment: CAP0402-105-6.3V-X7R)
C37  CAP0201-101-16V-X7R  [C0201]  (value not drawn)
C38  value 1uF 16V X7R  [C0402]  (hidden comment: CAP0402-105-6.3V-X7R)
C39  value 100pF 16V X7R  [C0201]  (hidden comment: CAP0201-101-16V-X7R)
C40  value 1uF 16V X7R  [C0402]  (hidden comment: CAP0402-105-6.3V-X7R)
C41  value 100pF 16V X7R  [C0201]  (hidden comment: CAP0201-101-16V-X7R)
C42  value 1uF 16V X7R  [C0402]  (hidden comment: CAP0402-105-6.3V-X7R)
C43  value 100pF 16V X7R  [C0201]  (hidden comment: CAP0201-101-16V-X7R)
C44  value 1uF 16V X7R  [C0402]  (hidden comment: CAP0402-105-6.3V-X7R)
C45  value 100pF 16V X7R  [C0201]  (hidden comment: CAP0201-101-16V-X7R)
C46  value 100pF 16V X7R  [C0201]  (hidden comment: CAP0201-101-16V-X7R)
C47  value 100pF 16V X7R  [C0201]  (hidden comment: CAP0201-101-16V-X7R)
C48  value 1uF 16V X7R  [C0402]  (hidden comment: CAP0402-105-6.3V-X7R)
C49  value 4.7uF 10V X5R  [C0402]  (hidden comment: CAP0402-475-10V-X5R)
C50  value 10pF 25V NP0  [C0201]  (hidden comment: CAP0201-100-25V-NP0)
C51  value 2pF 25V NP0  [C0201]  (hidden comment: CAP0201-020-25V-NP0)
C52  value 2pF 25V NP0  [C0201]  (hidden comment: CAP0201-020-25V-NP0)
C53  value NOP  [C0201_NOP]  (hidden comment: CAP0201-NOP)
C54  value NOP  [C0201_NOP]  (hidden comment: CAP0201-NOP)
C55  value NOP  [C0201_NOP]  (hidden comment: CAP0201-NOP)
C56  value 10pF 25V NP0  [C0201]  (hidden comment: CAP0201-100-25V-NP0)
C57  value 10pF 25V NP0  [C0201]  (hidden comment: CAP0201-100-25V-NP0)
C58  value 1.2PF 25V NP0  [C0201]  (hidden comment: CAP0201-1R2-25V-NP0)
C59  value 1.2PF 25V NP0  [C0201]  (hidden comment: CAP0201-1R2-25V-NP0)
C60  value 9pF 25V NP0  [C0201]  (hidden comment: CAP0201-090-100V-NP0)
C61  value 2pF 25V NP0  [C0201]  (hidden comment: CAP0201-020-25V-NP0)
C62  value 2pF 25V NP0  [C0201]  (hidden comment: CAP0201-020-25V-NP0)
L2  value 1.5nH  [L0201]  (hidden comment: IND0201_1.5N_600MA)
L3  value 1.5nH  [L0201]  (hidden comment: IND0201_1.5N_600MA)
L4  value 2.5nH  [L0201]  (hidden comment: IND0201_2.5N_500MA)
L5  value 2.5nH  [L0201]  (hidden comment: IND0201_2.5N_500MA)
L6  value 1.8nH 200mA  [L0201]  (hidden comment: IND0201_1.8N_200MA)
L7  value 1.5nH  [L0201]  (hidden comment: IND0201_1.5N_600MA)
R9  value 50R 1% 0.075W  [R0201]  (hidden comment: RES0201-50R0)
R12  value 50R 1% 0.075W  [R0201]  (hidden comment: RES0201-50R0)
U1  MT7688AN  [DR-QFN-128]  (part D of 6)
X3  R2520-40.000-12-F-1010-TR-NS1  [R2520-40.000-12-F-1010-TR-NS1]  (value not drawn)

### Blocks framed on the sheet
Termination: R9 R12

### Ports
3V3, ANT_OUT

### Nets
GND: A1.2(GND1) A1.3(GND2) C36.2 C37.2 C38.2 C39.2 C40.2 C41.2 C42.2 C43.2 C44.2 C45.2 C46.2 C47.2 C48.2 C49.2 C50.2 C51.1 C52.2 C54.2 C55.2 C58.2 C61.2 C62.2 L5.2 U1.1(AVSS33_RF_1) U1.2(AVSS33_RF_2) U1.7(AVSS33_RF) U1.10(AVSS33_RF_3) U1.13(AVSS33_RF_4) U1.152(AVSS33_XTAL) U1.156(WF0_LNA_EXT) X3.1 X3.2(GND1) X3.4(GND2)
3V3: C36.1 C37.1 C38.1 C39.1 C40.1 C41.1 C42.1 C43.1 C44.1 C45.1 C46.1 C47.1 C48.1 C49.1 C50.1 R9.2 R12.2 U1.8(AVDD33_WF0_TX) U1.14(AVDD33_WF1_TX) U1.15(AVDD33_WF1_TRX) U1.149(AVDD33_WF_RFDIG) U1.150(AVDD33_XTA) U1.154(AVDD33_WF_SX) U1.155(AVDD33_WF0_TRX) ; port 3V3
ANT_OUT: A1.1(RF) C62.1 L7.2 ; port ANT_OUT
CLKOUTP: U1.153(CLKOUTP)
RF_DIFF+: C56.1 C59.2 L5.1
RF_DIFF-: C57.1 C58.1 L4.1
RF_HP+: C55.1 C56.2 L2.2
RF_HP-: C54.1 C57.2 L3.2
RF_LP: C60.1 C61.1 L6.2 L7.1
RF_LP+: C51.2 C53.1 L2.1 R9.1 U1.5(WF0_RFIOP_1) U1.6(WF0_RFIOP_2)
RF_LP-: C52.1 C53.2 L3.1 R12.1 U1.3(WF0_RFION_1) U1.4(WF0_RFION_2)
RF_NOTCH: C59.1 C60.2 L4.2 L6.1
XTALIN: U1.151(XTALIN) X3.3

Not connected (* = marked no-connect by the designer): U1 9(NC_1) 11(NC_2) 12(NC_3)

### Notes on the sheet
- (near A1) 50Ohm Impedance
- (near C60) Notch filter
- (near C54) HP filter
- fc=1.25GHz
- LP filter
- fc=2.9Ghz
- Single End
- to
- fc=1/(2*pi*(L*C)^1/2)
- fc=2.9GHz
- Differential

### Library data of the parts
A1 = CONMHF1-SMD-G-T: CONN UMC JACK STR SMD; Manufacturer: Linx Technologies Inc.; Prefered Vender: Digikey; PCB DECAL: CONMHF1-SMD-G-T; Part Number: CONMHF1-SMD-G-T; Revision: A; Type: Connector
C36 C38 C40 C42 C44 C48 = CAP0402-105-6.3V-X7R: as C25 on sheet POWER; Revision: A
C37 C39 C41 C43 C45-C47 = CAP0201-101-16V-X7R: CAP CER 100PF 16V X7R 0201; Part Number: 0201B101K160CT; Manufacturer: Walsin Technology Corporation; Prefered Vender: Digikey; Aligni Value: 100p; Type: Capacitor; Geometry.Height: 0.33mm; PCB DECAL: RC0201; Revision: A
  C37: Value: 100pF 16V X7R
C49 = CAP0402-475-10V-X5R: as C26 on sheet POWER; Revision: A
C50 C56 C57 = CAP0201-100-25V-NP0: CAP CER 10PF 25V C0G/NP0 0201; Part Number: 0201N100J250CT; Manufacturer: Walsin Technology Corporation; Prefered Vender: Digikey; Aligni Value: 10p; Type: Capacitor; Geometry.Height: 0.33mm; PCB DECAL: RC0201; Revision: A
C51 C52 C61 C62 = CAP0201-020-25V-NP0: CAP CER 2PF 25V C0G/NP0 0201; Part Number: CL03C020BA3GNNC; Manufacturer: Samsung Electro-Mechanics; Prefered Vender: Digikey; Aligni Value: 2p; Type: Capacitor; Geometry.Height: 0.33mm; PCB DECAL: RC0201; Revision: A
C53-C55 = CAP0201-NOP: NOP; Aligni Value: 12p; Type: Capacitor; Geometry.Height: 0mm; PCB DECAL: RC0201; Prefered Vender: NOP; Revision: NOP; Part Number: NOP; Manufacturer: NOP
C58 C59 = CAP0201-1R2-25V-NP0: CAP CER 1.2PF 25V C0G/NP0 0201; Part Number: GRM0335C1E1R2WA01D; Manufacturer: Murata Electronics; Prefered Vender: Digikey; Aligni Value: 1.2P; Type: Capacitor; Geometry.Height: 0.33mm; PCB DECAL: RC0201; Revision: A
C60 = CAP0201-090-100V-NP0: CAP CER 9PF 25V C0G 0201; Part Number: CGA1A2C0G1E090D030BA; Manufacturer: TDK Corporation; Prefered Vender: Digikey; Aligni Value: 9p; Type: Capacitor; Geometry.Height: 0.33mm; PCB DECAL: RC0201; Revision: A
L2 L3 L7 = IND0201_1.5N_600MA: INDUCTOR FIXED 1.5NH 0201; Part Number: WLCM0603TGB1N5TB; Manufacturer: Walsin Technology Corporation; Prefered Vender: Digikey; Geometry.Height: 1.5mm; Aligni Value: 1.5n; PCB DECAL: RC0201; Revision: A; Type: Inductor
L4 L5 = IND0201_2.5N_500MA: FIXED IND 2.5NH 500MA 200MOHM SM; Part Number: LQP03TN2N5B02D; Manufacturer: Murata Electronics; Prefered Vender: Digikey; Geometry.Height: 1.5mm; Aligni Value: 2.5n; Type: Inductor; PCB DECAL: RC0201; Revision: A
L6 = IND0201_1.8N_200MA: FIXED IND 1.8NH 200MA 550MOHM SM; Part Number: 1-2176075-8; Manufacturer: TE Connectivity Passive Product; Prefered Vender: Digikey; Geometry.Height: 1.5mm; Aligni Value: 1.8n; Type: Inductor; PCB DECAL: RC0201; Revision: A
R9 R12 = RES0201-50R0: RES 50 OHM 0.1% 0.075W 0201; Manufacturer: Vishay Dale; Part Number: TNPW020150R0BEED; Geometry.Height: 0.5mm; Prefered Vender: Digikey; Aligni Value: 50; PCB DECAL: RC0201; Type: Resistor; Revision: A
U1 = MT7688AN: as U1 on sheet POWER; Type: IC; Part Number: MT7688AN; PCB DECAL: DR-QFN-128
X3 = R2520-40.000-12-F-1010-TR-NS1: CRYSTAL 40.0000MHZ 12PF SMD; Manufacturer: Raltron Electronics; Geometry.Height: 0.9mm; Aligni Value: 40Meg; Prefered Vender: Digikey; Value: 40Mhz; PCB DECAL: R2520-40.000-12-F-1010-TR-NS1; Type: Crystal; Part Number: R2520-40.000-12-F-1010-TR-NS1; Revision: A

## Sheet USB_PCIE.SchDoc: Network Module
size 431 x 279 mm; DrawnBy: Bin Xiao; Organization: RYSE Inc.
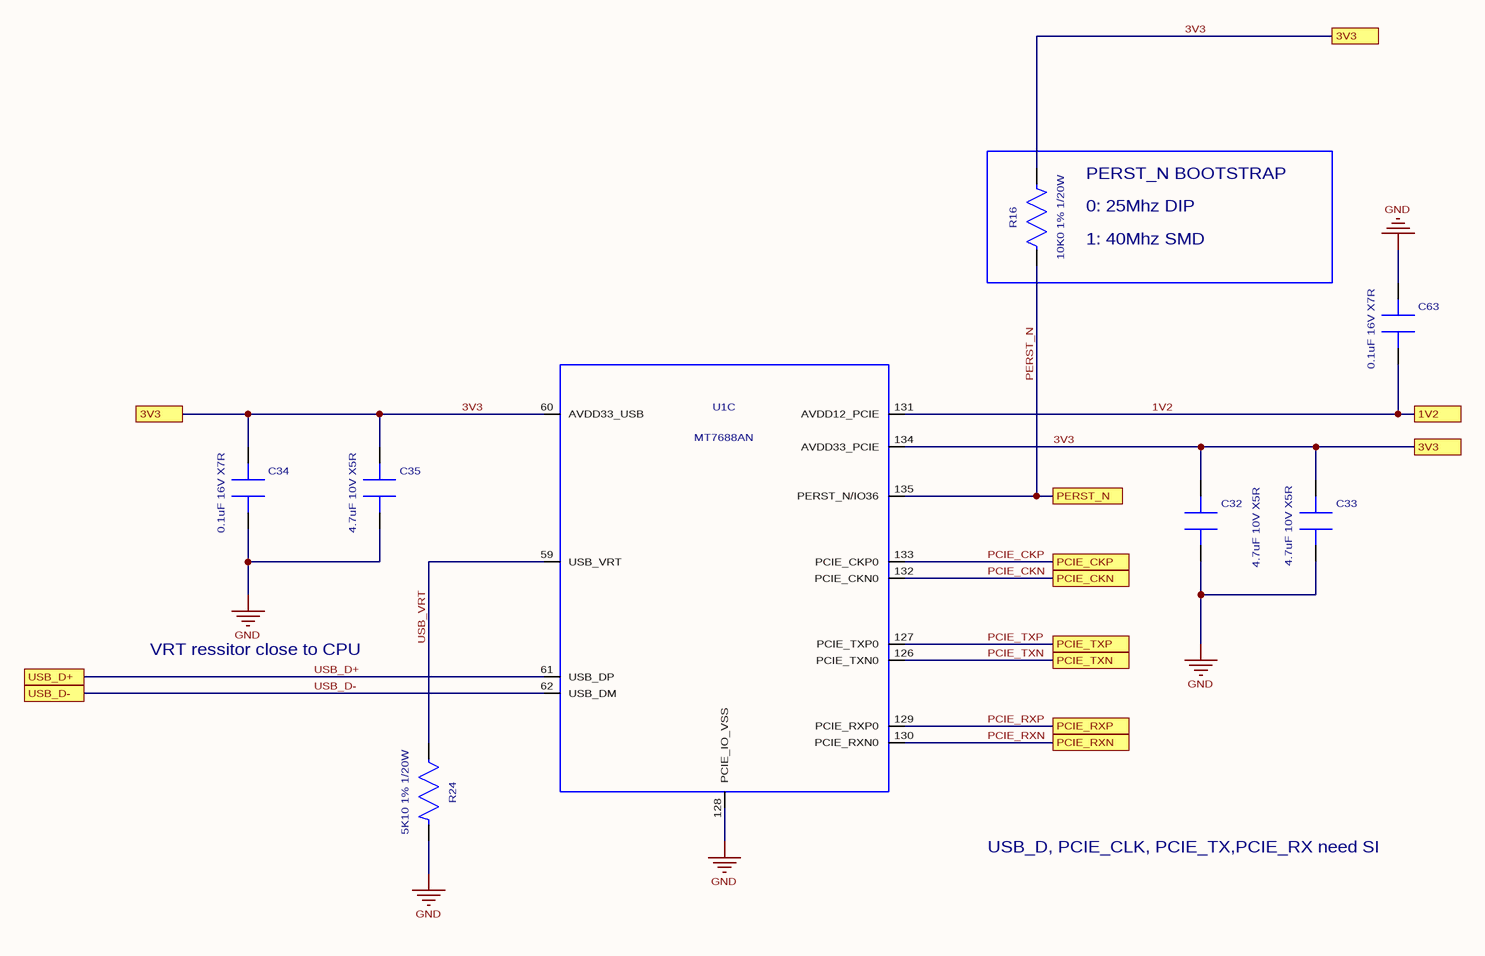
[diagram p7: USB_PCIE.SchDoc]

### Parts
C32  value 4.7uF 10V X5R  [RC0402]  (hidden comment: CAP0402-475-10V-X5R)
C33  value 4.7uF 10V X5R  [RC0402]  (hidden comment: CAP0402-475-10V-X5R)
C34  value 0.1uF 16V X7R  [RC0201]  (hidden comment: CAP0201-104-16V-X7R)
C35  value 4.7uF 10V X5R  [RC0402]  (hidden comment: CAP0402-475-10V-X5R)
C63  value 0.1uF 16V X7R  [RC0201]  (hidden comment: CAP0201-104-16V-X7R)
R16  value 10K0 1% 1/20W  [RC0201]  (hidden comment: RES0201-10K0)
R24  value 5K10 1% 1/20W  [RC0201]  (hidden comment: RES0201-5K10)
U1  MT7688AN  [DR-QFN-128]  (part C of 6)

### Ports
1V2, 3V3, PCIE_CKN, PCIE_CKP, PCIE_RXN, PCIE_RXP, PCIE_TXN, PCIE_TXP, PERST_N, USB_D+, USB_D-

### Nets
GND: C32.2 C33.2 C34.2 C35.2 C63.1 R24.2 U1.128(PCIE_IO_VSS)
1V2: C63.2 U1.131(AVDD12_PCIE) ; port 1V2
3V3: C32.1 C33.1 C34.1 C35.1 R16.2 U1.60(AVDD33_USB) U1.134(AVDD33_PCIE) ; port 3V3
PCIE_CKN: U1.132(PCIE_CKN0) ; port PCIE_CKN
PCIE_CKP: U1.133(PCIE_CKP0) ; port PCIE_CKP
PCIE_RXN: U1.130(PCIE_RXN0) ; port PCIE_RXN
PCIE_RXP: U1.129(PCIE_RXP0) ; port PCIE_RXP
PCIE_TXN: U1.126(PCIE_TXN0) ; port PCIE_TXN
PCIE_TXP: U1.127(PCIE_TXP0) ; port PCIE_TXP
PERST_N: R16.1 U1.135(PERST_N/IO36) ; port PERST_N
USB_D+: U1.61(USB_DP) ; port USB_D+
USB_D-: U1.62(USB_DM) ; port USB_D-
USB_VRT: R24.1 U1.59(USB_VRT)

### Notes on the sheet
- (near R16) PERST_N BOOTSTRAP
- (near R16) 0: 25Mhz DIP
- (near R16) 1: 40Mhz SMD
- VRT ressitor close to CPU
- USB_D, PCIE_CLK, PCIE_TX,PCIE_RX need SI

### Library data of the parts
C32 C33 C35 = CAP0402-475-10V-X5R: CAP CER 4.7UF 10V X5R 0402; Part Number: CL05A475MP5NRNC; Manufacturer: Samsung Electro-Mechanics; Prefered Vender: Digikey; Aligni Value: 4.7u; Type: Capacitor; Geometry.Height: 0.33mm; Revision: A; PCB DECAL: RC0402
C34 C63 = CAP0201-104-16V-X7R: CAP CER 0.1UF 16V X7R 0201; Part Number: GRM033Z71C104KE14D; Manufacturer: Murata Electronics; Prefered Vender: Digikey; Aligni Value: 0.1u; Type: Capacitor; Geometry.Height: 0.33mm; Revision: A; PCB DECAL: RC0201
R16 = RES0201-10K0: RES SMD 10K OHM 1% 1/20W 0201; Manufacturer: Yageo; Part Number: RC0201FR-0710KP; Geometry.Height: 0.5mm; Prefered Vender: Digikey; Type: Resistor; Revision: A; Aligni Value: 10k; PCB DECAL: RC0201
R24 = RES0201-5K10: RES SMD 5.1K OHM 1% 1/20W 0201; Part Number: AC0201FR-075K1L; Manufacturer: YAGEO; Prefered Vender: Digikey; Geometry.Height: 0.6mm; Aligni Value: 5.1k; Revision: A; Type: Resistor; PCB DECAL: RC0201
U1 = MT7688AN: as U1 on sheet POWER; Type: IC; Part Number: MT7688AN; PCB DECAL: DR-QFN-128

## Nets that join several sheets
GND: POWER (17 pins), MEMORY (41 pins), MISC (7 pins), ETH_JTAG_SD (5 pins), WIFI (35 pins), USB_PCIE (7 pins)
1V2: POWER (14 pins), USB_PCIE (C63.2 U1.131)
1V8: POWER (C26.1 C27.1 U1.125), MEMORY (37 pins)
3V3: POWER (10 pins), MISC (5 pins), ETH_JTAG_SD (8 pins), WIFI (24 pins), USB_PCIE (7 pins)